# EAGLE design DCP23 (EAGLE 9.3.0)

## Sheet 1 of 2
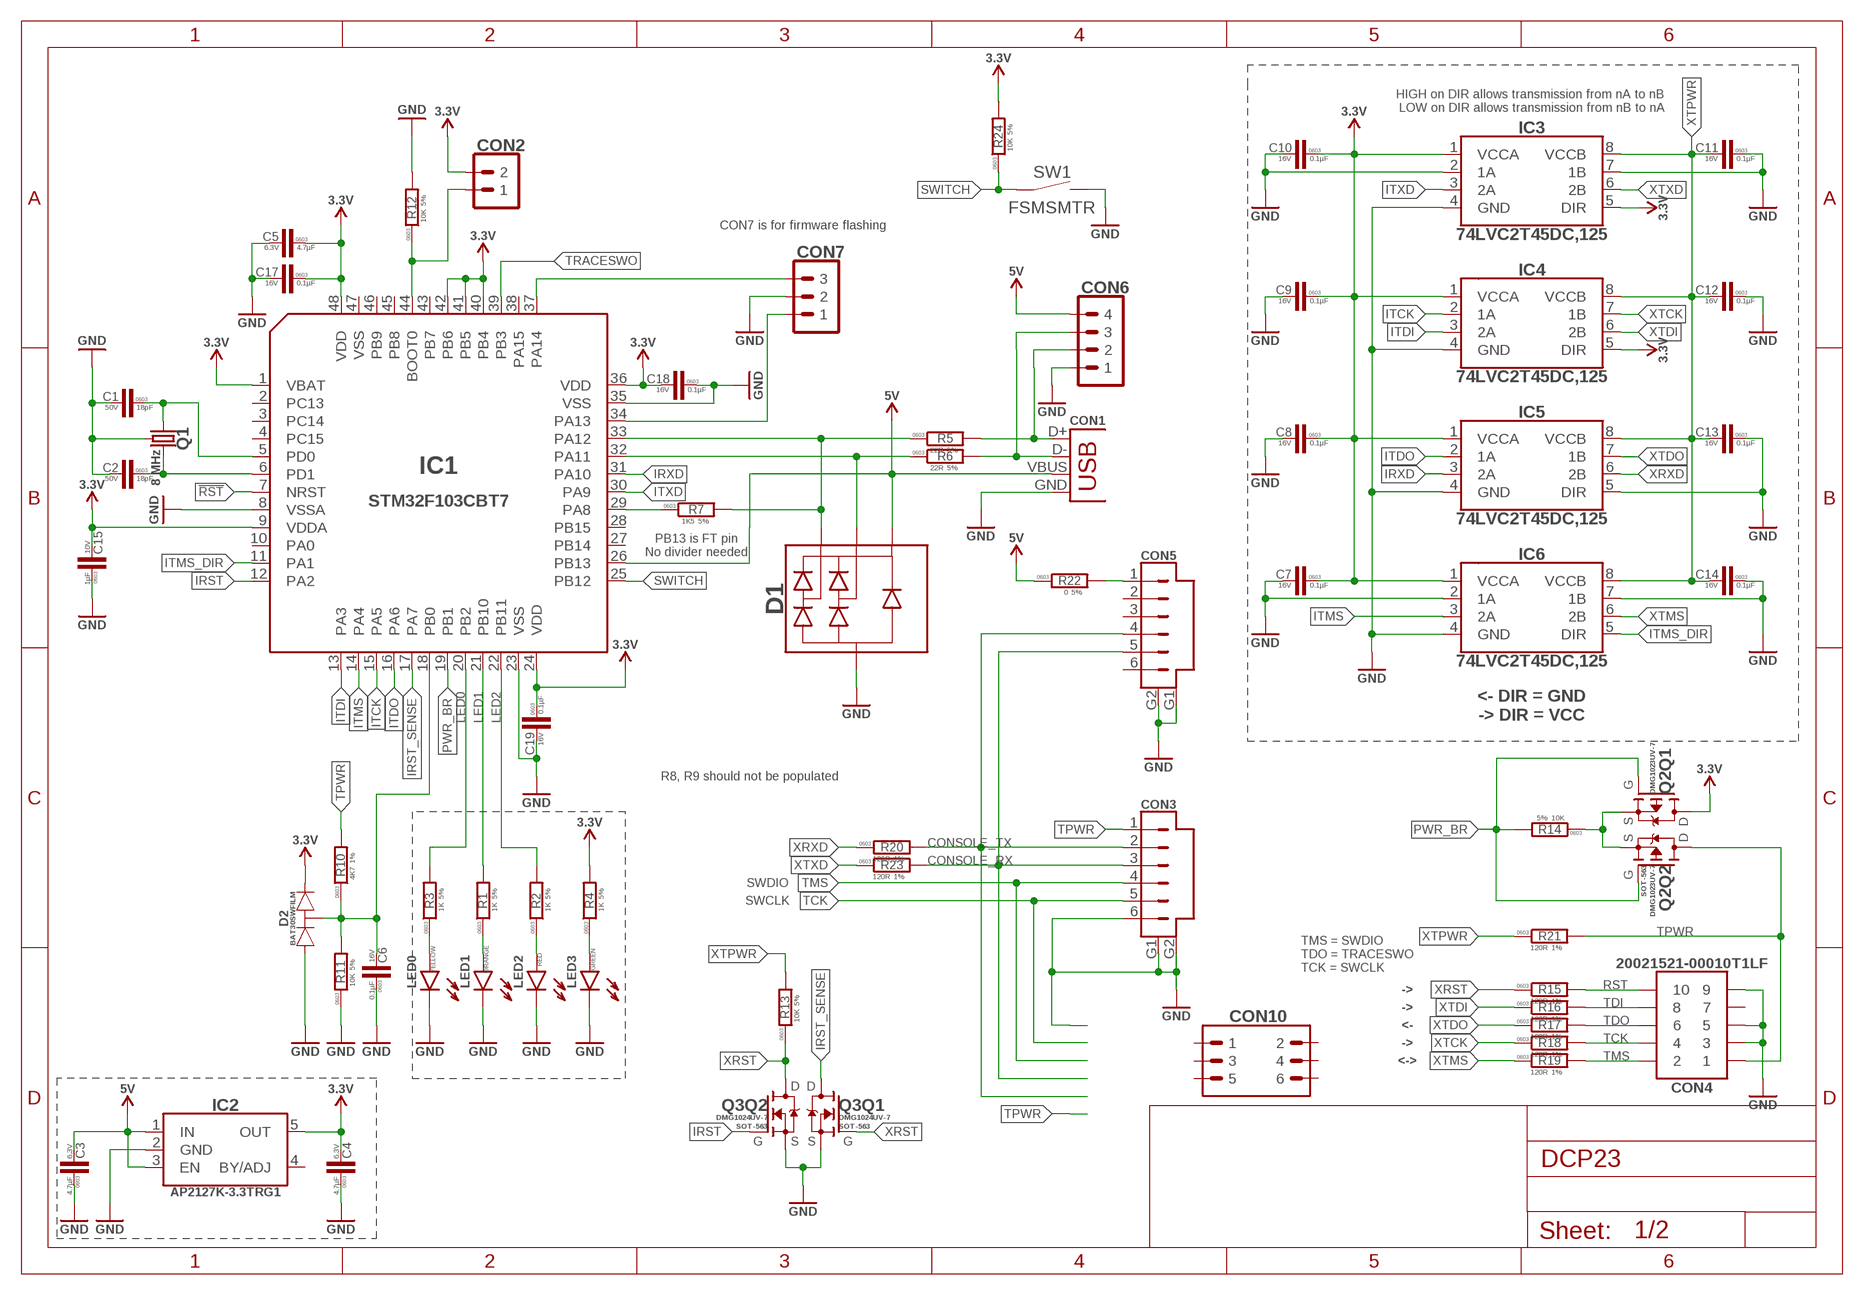
[diagram p0: schematic, sheet 1]

### Parts
C1  18pF  18PF-50V_5%_NP0-0603  [C0603]
C2  18pF  18PF-50V_5%_NP0-0603  [C0603]
C3  4.7µF  4.7µF-6.3V_10%_X5R-0603  [C0603]
C4  4.7µF  4.7µF-6.3V_10%_X5R-0603  [C0603]
C5  4.7µF  4.7µF-6.3V_10%_X5R-0603  [C0603]
C6  0.1µF  0.1µF-16V_10%_X7R-0603  [C0603]
C7  0.1µF  0.1µF-16V_10%_X7R-0603  [C0603]
C8  0.1µF  0.1µF-16V_10%_X7R-0603  [C0603]
C9  0.1µF  0.1µF-16V_10%_X7R-0603  [C0603]
C10  0.1µF  0.1µF-16V_10%_X7R-0603  [C0603]
C11  0.1µF  0.1µF-16V_10%_X7R-0603  [C0603]
C12  0.1µF  0.1µF-16V_10%_X7R-0603  [C0603]
C13  0.1µF  0.1µF-16V_10%_X7R-0603  [C0603]
C14  0.1µF  0.1µF-16V_10%_X7R-0603  [C0603]
C15  1µF  1µF-10V_10%_X5R-0603  [C0603]
C17  0.1µF  0.1µF-16V_10%_X7R-0603  [C0603]
C18  0.1µF  0.1µF-16V_10%_X7R-0603  [C0603]
C19  0.1µF  0.1µF-16V_10%_X7R-0603  [C0603]
CON1  USB-1  [MICRO_USB_WITH_PEGS]
CON2  PINHEAD_1X02-2  [1X02-PTH-2]
CON3  CON-6P-SM06B  [SM06B]
CON4  CON-2X5P  [200215-00010T1LF]
CON5  CON-6P-DF13  [DF13C-6P-1.25V]
CON6  PINHEAD_1X04-2.54  [1X04-PTH-2.54]
CON7  PINHEAD_1X03-2.54  [1X03-PTH-2.54]
CON10  PINHEAD_2X03-PTH-2.54  [2X03-PTH-2.54]
D1  PRTR5V0U2X  [SOT143B]
D2  BAT30SWFILM  [SC70]
IC1  STM32F103CBT7  [LQFP48]
IC2  AP2127-3.3  [SOT23-5]
IC3  74LVC2T45  [VSSOP8]
IC4  74LVC2T45  [VSSOP8]
IC5  74LVC2T45  [VSSOP8]
IC6  74LVC2T45  [VSSOP8]
LED0  LED-0603  [LED0603]
LED1  LED-0603  [LED0603]
LED2  LED-0603  [LED0603]
LED3  LED-0603  [LED0603]
Q1  8 MHz  CRYSTAL-4P-8MHZ-3.2X5-4P  [OSCILLATOR-5.0X3.2-4P]
Q2  DMG1023UV-7  [SOT-563]
Q3  DMG1024UV-7  [SOT-563]
R1  1K  1K-5%-0603  [R0603]
R2  1K  1K-5%-0603  [R0603]
R3  1K  1K-5%-0603  [R0603]
R4  1K  1K-5%-0603  [R0603]
R5  22R  R-5%-0603  [R0603]
R6  22R  R-5%-0603  [R0603]
R7  1K5  R-5%-0603  [R0603]
R10  4K7  4K7-1%-0603  [R0603]
R11  10K  10K-5%-0603  [R0603]
R12  10K  10K-5%-0603  [R0603]
R13  10K  10K-5%-0603  [R0603]
R14  10K  10K-5%-0603  [R0603]
R15  120R  120R-1%-0603  [R0603]
R16  120R  120R-1%-0603  [R0603]
R17  120R  120R-1%-0603  [R0603]
R18  120R  120R-1%-0603  [R0603]
R19  120R  120R-1%-0603  [R0603]
R20  120R  120R-1%-0603  [R0603]
R21  120R  120R-1%-0603  [R0603]
R22  0  0R-5%-0603  [R0603]
R23  120R  120R-1%-0603  [R0603]
R24  10K  10K-5%-0603  [R0603]
SW1  TACT_SWITCH-FSMSM  [FSMSM]

### Nets
!RST: IC1.7(NRST)
CONSOLE_RX: CON3.3 CON5.5 R23.P$2
CONSOLE_TX: CON3.2 CON5.4 R20.P$2
GND: C1.P$2 C2.P$2 C3.P$1 C4.P$1 C5.P$2 C6.P$1 C7.P$2 C8.P$2 C9.P$2 C10.P$2 C11.P$1 C12.P$1 C13.P$1 C14.P$1 C15.P$1 C17.P$2 C18.P$1 C19.P$2 CON1.GND CON3.6 CON3.G1 CON3.G2 CON4.3 CON4.5 CON4.9 CON5.G1(G2) CON5.G2(G1) CON6.1 CON7.2 D1.1(C) D2.1(A) IC1.8(VSSA) IC1.23(VSS) IC1.35(VSS) IC2.2(GND) IC3.2(1A) IC3.4(GND) IC3.7(1B) IC4.4(GND) IC5.4(GND) IC5.5(DIR) IC6.2(1A) IC6.4(GND) IC6.7(1B) LED0.C LED1.C LED2.C LED3.C Q1.2(GND) Q1.4(GND) Q3.1(Q1:S) Q3.4(Q2:S) R11.P$1 R12.P$2 SW1.P$2
IRST: IC1.12(PA2) Q3.5(Q2:G)
IRST_SENSE: IC1.17(PA7) Q3.6(Q1:D)
IRXD: IC1.31(PA10) IC5.3(2A)
ITCK: IC1.15(PA5) IC4.2(1A)
ITDI: IC1.13(PA3) IC4.3(2A)
ITDO: IC1.16(PA6) IC5.2(1A)
ITMS: IC1.14(PA4) IC6.3(2A)
ITMS_DIR: IC1.11(PA1) IC6.5(DIR)
ITXD: IC1.30(PA9) IC3.3(2A)
LED0: IC1.20(PB2) R3.P$2
LED1: IC1.21(PB10) R1.P$2
LED2: IC1.22(PB11) R2.P$2
N$1: C1.P$1 IC1.5(PD0) Q1.1
N$2: LED0.A R3.P$1
N$3: C2.P$1 IC1.6(PD1) Q1.3
N$4: LED2.A R2.P$1
N$5: LED1.A R1.P$1
N$6: LED3.A R4.P$1
N$7: IC1.29(PA8) R7.1
N$8: D1.3(D2) IC1.32(PA11) R6.1
N$9: D1.2(D1) IC1.33(PA12) R5.1 R7.2
N$10: CON1.D- CON6.3 R6.2
N$11: CON1.D+ CON6.2 R5.2
N$12: Q2.1(Q2:S) Q2.4(Q1:S) R14.P$1
N$13: CON5.1 R22.P$2
N$15: CON2.1 IC1.44(BOOT0) R12.P$1
PWR_BR: IC1.19(PB1) Q2.2(Q2:G) Q2.5(Q1:G) R14.P$2
RST: CON4.10 R15.P$2
SWCLK: CON7.3 IC1.37(PA14)
SWDIO: CON7.1 IC1.34(PA13)
SWITCH: IC1.25(PB12) R24.P$1 SW1.P$1
TCK: CON3.5 CON4.4 R18.P$2
TDI: CON4.8 R16.P$2
TDO: CON4.6 R17.P$2
TMS: CON3.4 CON4.2 R19.P$2
TPWR: CON3.1 CON4.1 Q2.6(Q2:D) R10.P$2 R21.P$2
TRACESWO: IC1.39(PB3)
VBUS1: C6.P$2 D2.3(COMMON) IC1.18(PB0) R10.P$1 R11.P$2
VDD_3V3: C4.P$2 C5.P$1 C7.P$1 C8.P$1 C9.P$1 C10.P$1 C15.P$2 C17.P$1 C18.P$2 C19.P$1 CON2.2 D2.2(C) IC1.1(VBAT) IC1.9(VDDA) IC1.24(VDD) IC1.36(VDD) IC1.40(PB4) IC1.41(PB5) IC1.42(PB6) IC1.48(VDD) IC2.5(OUT) IC3.1(VCCA) IC3.5(DIR) IC4.1(VCCA) IC4.5(DIR) IC5.1(VCCA) IC6.1(VCCA) Q2.3(Q1:D) R4.P$2 R24.P$2 ; supply symbol labelled 3.3V
VDD_5V: C3.P$2 CON1.VBUS CON6.4 D1.4(A) IC1.26(PB13) IC2.1(IN) IC2.3(EN) R22.P$1 ; supply symbol labelled 5V
XRST: Q3.2(Q1:G) Q3.3(Q2:D) R13.P$1 R15.P$1
XRXD: IC5.6(2B) R20.P$1
XTCK: IC4.7(1B) R18.P$1
XTDI: IC4.6(2B) R16.P$1
XTDO: IC5.7(1B) R17.P$1
XTMS: IC6.6(2B) R19.P$1
XTPWR: C11.P$2 C12.P$2 C13.P$2 C14.P$2 IC3.8(VCCB) IC4.8(VCCB) IC5.8(VCCB) IC6.8(VCCB) R13.P$2 R21.P$1
XTXD: IC3.6(2B) R23.P$1
Unconnected: CON4.7 CON5.2 CON5.3 CON5.6 CON10.1 CON10.2 CON10.3 CON10.4 CON10.5 CON10.6 IC1.2(PC13) IC1.3(PC14) IC1.4(PC15) IC1.10(PA0) IC1.27(PB14) IC1.28(PB15) IC1.38(PA15) IC1.43(PB7) IC1.45(PB8) IC1.46(PB9) IC1.47(VSS) IC2.4(BY/ADJ)

### Notes on the sheet
- HIGH on DIR allows transmission from nA to nB 
  LOW on DIR allows transmission from nB to nA
- CON7 is for firmware flashing
- PB13 is FT pin
  No divider needed
- <- DIR = GND
  -> DIR = VCC
- R8, R9 should not be populated
- SWDIO
- SWCLK
- TMS = SWDIO
  TDO = TRACESWO
  TCK = SWCLK
- ->
- ->
- <-
- ->
- <->

## Sheet 2 of 2

## Library data of the parts
C1 C2 = C_digikey:18PF; DIGIKEY#: 445-1272-2-ND; MANF: TDK Corporation; MANF#: C1608C0G1H180J080AA; OPERATING_TEMP: -55°C ~ 125°C; PACKAGE: 0603; TC: C0G, NP0; TOLERANCE: +-5%; VOLTAGE: 50V
C3-C5 = C_digikey:4.7µF; DIGIKEY#: 490-3297-1-ND; MANF: Murata Electronics North America; MANF#: GRM188R60J475KE19D; OPERATING_TEMP: -55°C ~ 85°C; PACKAGE: 0603; TC: X5R; TOLERANCE: +-10%; VOLTAGE: 6.3V
C6-C14 C17-C19 = C_digikey:0.1µF; DIGIKEY#: 490-1532-1-ND; MANF: Murata Electronics North America; MANF#: GRM188R71C104KA01D; OPERATING_TEMP: -55°C ~ 125°C; PACKAGE: 0603; TC: X7R; TOLERANCE: +-10%; VOLTAGE: 16V
C15 = C_digikey:1µF; DIGIKEY#: 490-1543-1-ND; MANF: Murata Electronics North America; MANF#: GRM188R61A105KA61D; OPERATING_TEMP: -55°C ~ 85°C; PACKAGE: 0603; TC: X5R; TOLERANCE: +-10%; VOLTAGE: 10V
CON1 = Connectors:USB: Connector Receptacle USB - micro B 2.0 5 Position; DIGIKEY#: 609-4616-1-ND; MANF: FCI; MANF#: 10118193-0001LF
CON2 = pinhead:PINHEAD_1X02: pinheader 2P
CON3 = Connectors:CON-6P: CONN HEADER 6 POS; DIGIKEY#: 455-1806-1-ND; MANF: JST Sales America Inc; MANF#: SM06B-SRSS-TB(LF)(SN)
CON4 = Connectors:CON-2X5P; DIGIKEY#: 609-4054-ND; MANF: Amphenol ICC (FCI); MANF#: 20021521-00010T1LF
CON5 = Connectors:CON-6P: CONN HEADER 6 POS; DIGIKEY#: H3423-ND; MANF: Hirose Electric Co Ltd; MANF#: DF13C-6P-1.25V(20)
CON6 = pinhead:PINHEAD_1X04
CON7 = pinhead:PINHEAD_1X03: pinheader 3P
CON10 = pinhead:PINHEAD_2X03
D1 = TVS_diodes:PRTR5V0U2X; DIGIKEY#: 568-4140-2-ND; MANF: NXP USA Inc; MANF#: PRTR5V0U2X,215
D2 = Diodes:BAT30SWFILM: Diode Array 1 Pair Series Connection Schottky 30V 300mA (DC) Surface Mount SC-70, SOT-323; DIGIKEY#: 497-5553-2-ND; MANF: STMicroelectronics; MANF#: BAT30SWFILM
IC1 = stm32:STM32F103CBT7: ARM® Cortex®-M3 STM32F1 Microcontroller IC 32-Bit 72MHz 128KB (128K x 8) FLASH 48-LQFP (7x7); DIGIKEY#: 497-11518-ND; MANF: STMicroelectronics; MANF#: STM32F103CBT7
IC2 = linear regulators:AP2127: IC REG LINEAR 3.3V 300MA SOT23-5; DIGIKEY#: AP2127K-3.3TRG1DITR-ND; I_MAX: 300mA; MANF: Diodes Incorporated; MANF#: AP2127K-3.3TRG1; V_MAX: 6V
IC3-IC6 = misc:74LVC2T45: Voltage Level Translator Bidirectional 1 Circuit 2 Channel 420Mbps; DIGIKEY#: 1727-4578-2-ND; MANF: Nexperia USA Inc; MANF#: 74LVC2T45DC,125
LED0 = rc:LED: SMD LED; COLOR: YELLOW
LED1 = rc:LED: SMD LED; COLOR: ORANGE
LED2 = rc:LED: SMD LED; COLOR: RED
LED3 = rc:LED: SMD LED; COLOR: GREEN
Q1 = crystal:CRYSTAL-4P: Smd Crystal 18pF; DIGIKEY#: 535-9720-2-ND; MANF: Abracon LLC; MANF#: ABM3B-8.000MHZ-B2-T
Q2 = mosfet:DMG1023UV-7: Mosfet Array 2 P-Channel (Dual) 20V 1.03A 530mW Surface Mount SOT-563; DIGIKEY#: DMG1023UV-7DICT-ND; MANF: Diodes Incorporated; MANF#: DMG1023UV-7; PACKAGE: SOT-563
Q3 = mosfet:DMG1024UV-7: Mosfet Array 2 N-Channel (Dual) 20V 1.38A 530mW Surface Mount SOT-563; DIGIKEY#: DMG1024UV-7DICT-ND; MANF: Diodes Incorporated; MANF#: DMG1024UV-7; PACKAGE: SOT-563
R1-R4 = R_digikey:1K; DIGIKEY#: 311-1.0KGRCT-ND; MANF: Yageo; MANF#: RC0603JR-071KL; PACKAGE: 0603; TOLERANCE: 5%
R5 R6 = rc:R; DIGIKEY#: 311-22NCT-ND; MANF: Yageo; MANF#: RC0201JR-0722RL; PACKAGE: 0603; TOLERANCE: 5%
R7 = rc:R; DIGIKEY#: 311-1.50KHRCT-ND; MANF: Yageo; MANF#: RC0603FR-071K5L; PACKAGE: 0603; TOLERANCE: 5%
R10 = R_digikey:4K7; DIGIKEY#: 311-4.70KHRCT-ND; MANF: Yageo; MANF#: RC0603FR-074K7L; PACKAGE: 0603; TOLERANCE: 1%
R11-R14 R24 = R_digikey:10K; DIGIKEY#: 311-10KGRCT-ND; MANF: Yageo; MANF#: RC0603JR-0710KL; PACKAGE: 0603; TOLERANCE: 5%
R15-R21 R23 = R_digikey:120R; DIGIKEY#: YAG3563CT-ND; MANF: Yageo; MANF#: AC0603FR-07120RL; PACKAGE: 0603; TOLERANCE: 1%
R22 = R_digikey:0R; DIGIKEY#: 311-0.0GRCT-ND; MANF: Yageo; MANF#: RC0603JR-070RL; PACKAGE: 0603; TOLERANCE: 5%
SW1 = misc:TACT_SWITCH: tact switch; DIGIKEY#: 450-1140-ND; I: 0.05A; MANF: TE Connectivity ALCOSWITCH Switches; MANF#: FSMSMTR; V: 24V

## Board
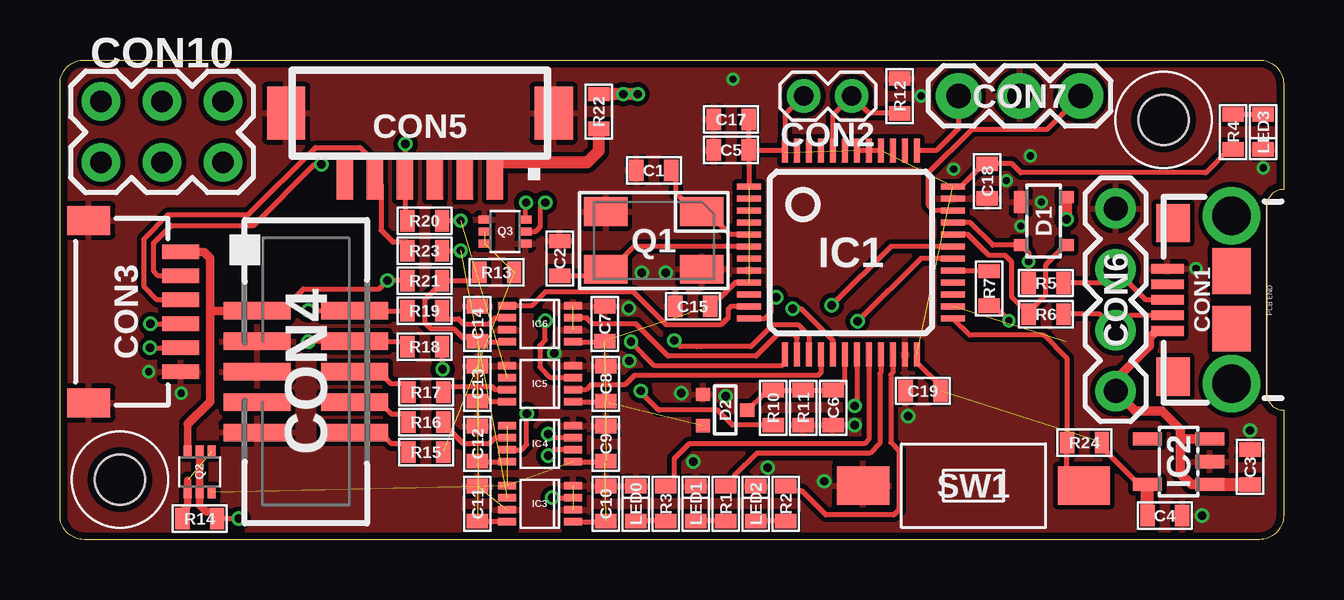
[diagram p1: board, top side]
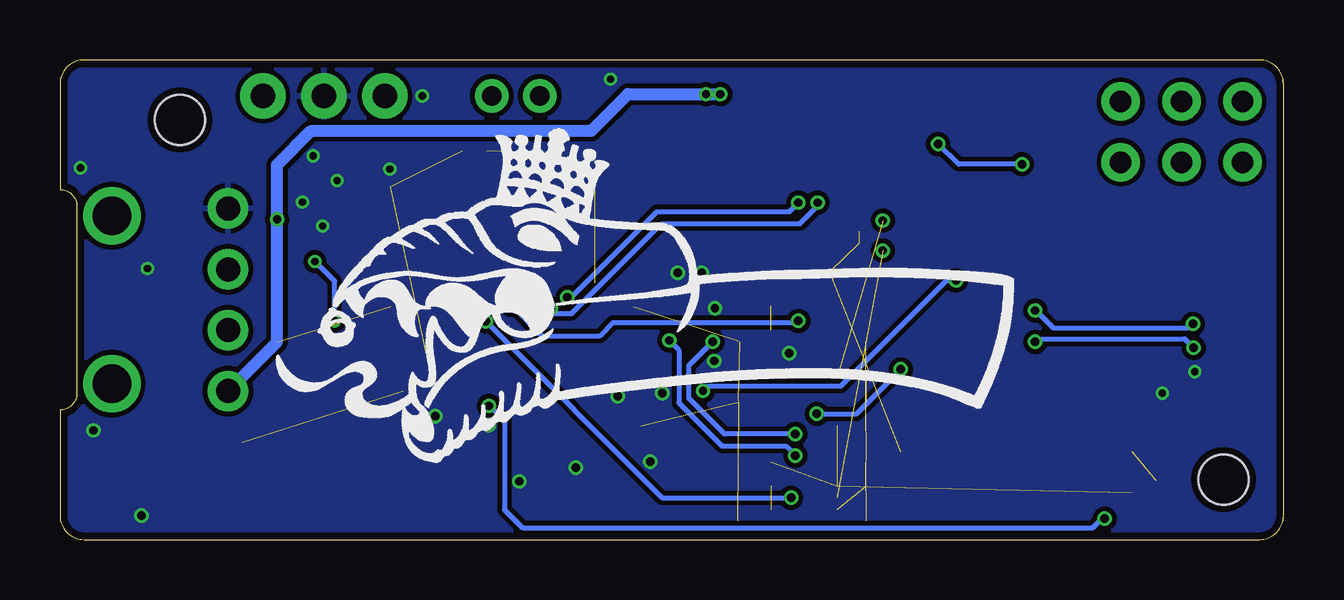
[diagram p2: board, bottom side, seen from below]

Size 51 x 20 mm. Coordinates in mm from the lower left corner, seen from the top.
Outline: 51,5.4 51,1 arc-90 50,0 1,0 arc-90 0,1 0,19 arc-90 1,20 50,20 arc-90 51,19 51,14.6 arc90 50.3,13.9 50.3,12.7 50.3,6.1 arc90 51,5.4
Copper layers (1*16): Top 0.035mm / dielectric 0.5mm / Bottom 0.035mm
Design rules "design_rules *": minimum track width 0.2mm, minimum drill 0.2mm, track to track 0.2mm, track to pad 0.2mm, pad to pad 0.2mm, via to via 0.2mm, smd to smd 0.15mm, copper to edge 0.3mm, drill to drill 0.2mm, minimum pad ring 0.125mm, minimum via ring 0.125mm, stop-mask expansion 1mil, vias tented up to drill 0.31mm, thermal gap 8mil
Holes 2.1 mm at 2.5,2.5 46,17.5

### Footprints (pad centres in the part's own frame; a part is rotated, then mirrored left to right if it is on the bottom)
C0603 = smd 0.6 x 0.9: P$1 -0.725,0; P$2 0.725,0
MICRO_USB_WITH_PEGS = smd 0.4 x 1.35: D+ 0,1.44; D- -0.65,1.44; GND 1.3,1.44; ID 0.65,1.44; VBUS -1.3,1.44 | smd 1.9 x 1.6: GND1 -1.2,-1.24; GND2 1.2,-1.24 | smd 1.6 x 1.4: GND3 -3.2,1.21; GND4 3.2,1.21 | drill 1.6 pad 2: P$1 -3.5,-1.24; P$2 3.5,-1.24
1X02-PTH-2 = drill 0.8 pad 1.4: 1 -1,0; 2 1,0
SM06B = smd 0.6 x 1.55: 1 -2.5,2.275; 2 -1.5,2.275; 3 -0.5,2.275; 4 0.5,2.275; 5 1.5,2.275; 6 2.5,2.275 | smd 1.2 x 1.8: G1 -3.8,-1.55; G2 3.8,-1.55
200215-00010T1LF = smd 0.737 x 2.794: 1 -2.54,-2.032; 2 -2.54,2.032; 3 -1.27,-2.032; 4 -1.27,2.032; 5 0,-2.032; 6 0,2.032; 7 1.27,-2.032; 8 1.27,2.032; 9 2.54,-2.032; 10 2.54,2.032
DF13C-6P-1.25V = smd 0.7 x 1.8: 1 -3.125,2.17; 2 -1.875,2.17; 3 -0.625,2.17; 4 0.625,2.17; 5 1.875,2.17; 6 3.125,2.17 | smd 1.6 x 2.2: G1 -5.575,-0.53; G2 5.575,-0.53
1X04-PTH-2.54 = drill 1 pad 1.7: 1 -3.81,0; 2 -1.27,0; 3 1.27,0; 4 3.81,0
1X03-PTH-2.54 = drill 1.016 pad 1.88: 1 -2.54,0; 2 0,0; 3 2.54,0
2X03-PTH-2.54 = drill 0.9 pad 1.6: 1 -1.27,2.54; 2 1.27,2.54; 3 -1.27,0; 4 1.27,0; 5 -1.27,-2.54; 6 1.27,-2.54
SOT143B = smd 0.9 x 0.6: 1 -0.8,-0.95 | smd 0.5 x 0.6: 2 1,-0.95; 3 1,0.95; 4 -1,0.95
SC70 = smd 0.55 x 0.6: 1 -0.65,-0.925; 2 0.65,-0.925; 3 0,0.925
LQFP48 = smd 1 x 0.25: 1 -4.25,2.75; 2 -4.25,2.25; 3 -4.25,1.75; 4 -4.25,1.25; 5 -4.25,0.75; 6 -4.25,0.25; 7 -4.25,-0.25; 8 -4.25,-0.75; 9 -4.25,-1.25; 10 -4.25,-1.75; 11 -4.25,-2.25; 12 -4.25,-2.75; 25 4.25,-2.75; 26 4.25,-2.25; 27 4.25,-1.75; 28 4.25,-1.25; 29 4.25,-0.75; 30 4.25,-0.25; 31 4.25,0.25; 32 4.25,0.75; 33 4.25,1.25; 34 4.25,1.75; 35 4.25,2.25; 36 4.25,2.75 | smd 0.25 x 1: 13 -2.75,-4.25; 14 -2.25,-4.25; 15 -1.75,-4.25; 16 -1.25,-4.25; 17 -0.75,-4.25; 18 -0.25,-4.25; 19 0.25,-4.25; 20 0.75,-4.25; 21 1.25,-4.25; 22 1.75,-4.25; 23 2.25,-4.25; 24 2.75,-4.25; 37 2.75,4.25; 38 2.25,4.25; 39 1.75,4.25; 40 1.25,4.25; 41 0.75,4.25; 42 0.25,4.25; 43 -0.25,4.25; 44 -0.75,4.25; 45 -1.25,4.25; 46 -1.75,4.25; 47 -2.25,4.25; 48 -2.75,4.25
SOT23-5 = smd 0.55 x 1.2: 1 -0.95,-1.3; 2 0,-1.3; 3 0.95,-1.3; 4 0.95,1.3; 5 -0.95,1.3
VSSOP8 = smd 0.75 x 0.3: 1 -1.375,0.75; 2 -1.375,0.25; 3 -1.375,-0.25; 4 -1.375,-0.75; 5 1.375,-0.75; 6 1.375,-0.25; 7 1.375,0.25; 8 1.375,0.75
LED0603 = smd 0.6 x 0.9: A -0.725,0; C 0.725,0
OSCILLATOR-5.0X3.2-4P = smd 1.8 x 1.2: 1 -2,-1.2; 2 2,-1.2; 3 2,1.2; 4 -2,1.2
SOT-563 = smd 0.5 x 0.325: 1 -0.85,0.5; 2 -0.85,0; 3 -0.85,-0.5; 4 0.85,-0.5; 5 0.85,0; 6 0.85,0.5
R0603 = smd 0.6 x 0.9: P$1 -0.725,0; P$2 0.725,0
R0603' = smd 0.6 x 0.9: 1 -0.725,0; 2 0.725,0
FSMSM = smd 2.18 x 1.6: P$1 -4.6,0; P$2 4.6,0

### Placement (x,y rotation side)
C1  24.75,15.4 180 top
C2  20.82,11.72 90 top
C3  49.6,3.03 270 top
C4  46.05,1 180 top
C5  27.98,16.25 180 top
C6  32.23,5.5 90 top
C7  22.7,9 90 top
C8  22.75,6.5 90 top
C9  22.75,4 90 top
C10  22.75,1.5 90 top
C11  17.4,1.5 270 top
C12  17.4,4 270 top
C13  17.4,6.5 270 top
C14  17.4,9 270 top
C15  26.38,9.72 0 top
C17  27.98,17.52 180 top
C18  38.65,14.95 90 top
C19  35.98,6.2 180 top
CON1  47.6,10 90 top
CON2  32,18.5 180 top
CON3  2.75,9.5 270 top
CON4  10.25,7 270 top
CON5  15,17.25 180 top
CON6  44,10 270 top
CON7  40,18.5 180 top
CON10  4.25,17 90 top
D1  41,13.28 270 top
D2  27.73,5.4 270 top
IC1  32.98,11.97 0 top
IC2  46.62,3.25 90 top
IC3  20,1.5 180 top
IC4  20,4 180 top
IC5  20,6.5 180 top
IC6  20,9 180 top
LED0  24,1.5 90 top
LED1  26.5,1.5 90 top
LED2  29,1.5 90 top
LED3  50.15,17 270 top
Q1  24.75,12.47 180 top
Q2  5.82,2.83 90 top
Q3  18.55,12.85 0 top
R1  27.75,1.5 90 top
R2  30.25,1.5 90 top
R3  25.25,1.5 90 top
R4  48.9,17 270 top
R5  22R  [R0603']  41.1,10.7 0 top
R6  22R  [R0603']  41.1,9.4 0 top
R7  1K5  [R0603']  38.73,10.47 270 top
R10  29.73,5.5 270 top
R11  30.98,5.5 90 top
R12  35,18.5 90 top
R13  18.2,11.15 180 top
R14  5.82,0.88 0 top
R15  15.25,3.65 180 top
R16  15.25,4.9 180 top
R17  15.25,6.15 180 top
R18  15.2,8.05 180 top
R19  15.2,9.55 180 top
R20  15.2,13.3 180 top
R21  15.2,10.8 180 top
R22  22.45,17.85 270 top
R23  15.2,12.05 180 top
R24  42.7,4.05 0 top
SW1  38.08,2.25 180 top
U$1  [DRAGON-30X13]  42,3.15 0 bottom

### Tracks (layer width: path | path; a pad name or v marks a point on that pad's centre or on a via)
CONSOLE_RX
  Top 0.2: CON3.3 4.05,10 3.5,10.55 3.5,12.54 4.51,13.55 7.85,13.55 10.65,16.35 12.5,16.35 13.1,15.75 13.1,15.05 | 13.1,15.05 CON5.5 13.38,14.83 13.38,12.9 13.88,12.4 14.47,12.4 R23.P$2 | 13.1,14.45 13.1,15.05
CONSOLE_TX  (via drill 0.35)
  Top 0.2: CON3.2 4.1,11 3.9,11.2 3.9,12.37 4.63,13.1 8.07,13.1 10.62,15.65 v10.9,15.65 | v14.4,16.5 14.38,16.48 CON5.4 14.38,13.4 R20.P$2
  Bottom 0.2: v10.9,15.65 13.55,15.65 v14.4,16.5
GND  (via drill 0.3 pad 0.55, 0.35)  (4 unrouted)
  Top 0.2: 35.12,6.33 C19.P$2 | D1.1 40.15,14.07 | 38.5,14.38 C18.P$1
  other vias: 47.35,11.3 50.15,15.5 40.9,14.07 31.85,2.42 29.5,3 26.4,3.25 49.6,4.55 47.6,1 33.12,4.78 27.75,5.97 39.45,14.97 35.35,5.15 40.45,16 37.25,15.45 35.9,18.5 28.05,19.2 40.05,13.07 5.05,6.1 3.7,7 25.9,6.1 23.7,9.65 24.25,11.12 25.25,11.12 23.73,7.45 20.6,7.78
  pour Bottom: 0,20 51,20 51,0 0,0
  pour Top: 0,20 51,20 51,0 0,0
IRST  (via drill 0.35)
  Top 0.2: IC1.12 29.38,9.22 29.65,9.5 29.65,9.9 v29.85,10.1 | Q3.5 19.82,12.85 20.02,13.05 20.02,13.85 v20.23,14.05
  Bottom 0.2: v29.85,10.1 29.7,10.1 26.12,13.68 20.6,13.68 v20.23,14.05
IRST_SENSE  (via drill 0.35)
  Top 0.2: IC1.17 32.23,8.3 30.9,9.62 v30.55,9.62 | Q3.6 19.4,14.03 v19.43,14.05
  Bottom 0.2: v30.55,9.62 30.35,9.43 29.68,9.43 25.93,13.18 20.15,13.18 19.43,13.9 v19.43,14.05
IRXD  (via drill 0.35)
  Top 0.2: IC1.31 34.62,12.22 v32.17,9.77 | IC5.3 20.45,6.75 20,7.2 20,8.1 20.23,8.32 v20.23,9.12
  Bottom 0.2: v32.17,9.77 30.9,8.5 28.5,8.5 27.95,9.05 20.3,9.05 v20.23,9.12
ITCK  (via drill 0.35)
  Top 0.2: IC1.15 31.23,8.5 30.77,8.95 29.7,8.95 28.8,8.05 26.7,8.05 | 26.7,8.05 26.55,8.05 | 26.7,8.05 25.85,8.05 v25.6,8.3 | IC4.2 20.6,3.75 v20.35,3.5
  Bottom 0.2: v25.6,8.3 25.2,7.9 25.2,5.7 23.4,3.9 20.75,3.9 v20.35,3.5
ITDI  (via drill 0.35)
  Top 0.2: IC1.13 30.23,7.4 30.07,7.25 24.78,7.25 23.8,8.23 v23.8,8.25 | IC4.3 20.5,4.25 v20.35,4.4
  Bottom 0.2: v23.8,8.25 24.8,7.25 24.8,5.9 23.3,4.4 v20.35,4.4
ITDO
  Top 0.2: IC1.16 31.73,6.97 31.6,6.85 23.95,6.85 23.55,6.45 22.12,6.45 21.92,6.25 IC5.2
ITMS
  Top 0.2: IC1.14 30.73,8.43 30.6,8.55 29.92,8.55 29.02,7.65 25.35,7.65 24,9 22.2,9 21.95,9.25 IC6.3
ITMS_DIR
  Top 0.2: IC1.11 27.98,9.72 27.85,9.6 27.85,9.25 27.55,8.95 25.27,8.95 23.9,10.32 20.23,10.32 19.65,9.75 IC6.5
ITXD  (via drill 0.35)
  Top 0.2: IC1.30 35.88,11.72 v33.25,9.1 | v20.52,1.75 IC3.3
  Bottom 0.2: v33.25,9.1 25.9,1.75 v20.52,1.75
LED0
  Top 0.2: IC1.20 33.73,4.2 33.52,4 26.23,4 25.6,3.38 25.6,2.25 25.57,2.22 R3.P$2
LED1
  Top 0.2: IC1.21 34.23,6.97 34.17,6.92 34.17,4.03 33.75,3.6 29.05,3.6 28.1,2.65 28.1,2.33 28,2.22 R1.P$2
LED2
  Top 0.2: IC1.22 34.73,6.97 34.62,6.88 34.62,4.05 34.98,3.7 34.98,1.25 34.75,1.03 31.93,1.03 30.93,2.03 30.45,2.03 R2.P$2
N$1
  Top 0.2: IC1.5 27.93,12.72 26.98,13.68 Q1.1 | Q1.1 26.55,13.68 | Q1.1 26.45,13.68 25.68,14.45 25.68,15.2 C1.P$1
N$2
  Top 0.2: 24.9,0.78 R3.P$1 LED0.A
N$3
  Top 0.2: IC1.6 23.93,12.22 22.98,11.28 Q1.3 arc-90 22.48,11 C2.P$1
N$4
  Top 0.2: R2.P$1 LED2.A
N$5
  Top 0.2: 27.4,0.78 R1.P$1 LED1.A
N$6
  Top 0.2: LED3.A R4.P$1
N$7
  Top 0.2: IC1.29 38.73,11.22 R7.1
N$8
  Top 0.2: D1.3 41.9,12.28 41.1,11.47 41.1,10.2 40.38,9.47 R6.1 39.67,10.1 39.67,11.57 39.4,11.85 38.73,11.85 37.85,12.72 IC1.32
N$9  (via drill 0.3 pad 0.55)
  Top 0.2: 40.25,10.82 R5.1 | R5.1 40.17,10.9 | R5.1 v40.38,11.6 40.38,11.95 D1.2 38.88,12.28 37.92,13.22 IC1.33 | R7.2 38.95,9.75 39.55,9.15 v39.55,9.12
  Bottom 0.2: v39.55,9.12 39.55,10.78 v40.38,11.6
N$10
  Top 0.2: CON1.D- 44.62,9.35 CON6.3 43.33,9.4 R6.2
N$11
  Top 0.2: CON1.D+ 45.27,10 CON6.2 43.43,10.7 R5.2
N$12  (1 unrouted)
  Top 0.32: 5.32,2.47 Q2.1 5.32,1.4 5.1,1.18 R14.P$1
N$13
  Top 0.5: R22.P$2 22.45,16.2 21.98,15.72 18.18,15.72 18.12,15.68 CON5.1
N$15
  Top 0.2: IC1.44 32.23,17.73 CON2.1 33.73,17.77 R12.P$1
PWR_BR  (via drill 0.35)
  Top 0.2: IC1.19 33.23,5.67 v33.12,5.58 | v7.45,0.88 6.68,0.88 6.55,1
  Top 0.32: R14.P$2 6.55,1 6.4,1.15 6.1,1.15 5.82,1.43 Q2.2 Q2.5
  Bottom 0.2: v33.12,5.58 33.08,5.58 32.48,4.97 32.48,1.25 31.73,0.5 7.95,0.5 7.57,0.88 v7.45,0.88
RST
  Top 0.2: CON4.10 12.53,4.21 13.62,4.21 13.82,4 14.47,4 14.53,3.95 R15.P$2
SWCLK
  Top 0.2: CON7.3 37.46,17.16 36.52,16.23 IC1.37
SWDIO
  Top 0.2: IC1.34 36.42,13.72 36.2,13.95 36.2,15.3 38.02,17.12 41.16,17.12 CON7.1
SWITCH
  Top 0.2: 41.98,2.95 SW1.P$1 41.98,2.95 | 37.62,9.22 IC1.25 37.92,8.53 41,8.53 41.98,7.55 R24.P$1 41.98,2.95
TCK  (via drill 0.35)
  Top 0.2: R18.P$2 14.26,8.27 CON4.4 10.37,8.27 v10.35,8.25 | v3.75,8 CON3.5
  Bottom 0.2: v10.35,8.25 10.23,8.38 4.12,8.38 v3.75,8
TDI
  Top 0.2: 12.35,5.8 CON4.8 13.32,5.73 13.8,5.25 14.4,5.25 14.53,5.12 R16.P$2
TDO
  Top 0.2: CON4.6 12.53,6.75 13.55,6.75 13.8,6.5 14.53,6.5 R17.P$2
TMS  (via drill 0.35)
  Top 0.2: v10.35,9.55 v10.36,9.54 CON4.2 R19.P$2 | v3.77,9 CON3.4
  Bottom 0.2: v10.35,9.55 10.32,9.55 9.6,8.82 3.95,8.82 v3.77,9
TPWR  (via drill 0.35)
  Top 0.2: CON4.1 9.24,9.54 10.15,10.45 13.3,10.45 v13.65,10.8 R21.P$2 14.47,10.45 | R10.P$2 28.02,4.78 27.4,5.4 24.95,5.4 24.2,6.15 v24.2,6.2
  Top 0.32: Q2.6 5.32,4.83
  Top 0.35: 5.32,4.83 6.25,5.75 6.25,9.5 | CON3.1 6,12 6.25,11.75 6.25,9.5 | CON4.1 6.29,9.54 6.25,9.5
  Top 0.4: 7.16,9.54 CON4.1
  Bottom 0.2: v24.2,6.2 24,6.4 18.45,6.4 14.05,10.8 v13.65,10.8
VBUS1
  Top 0.2: IC1.18 32.73,6.62 32.33,6.22 C6.P$2 R11.P$2 R10.P$1 29.62,6.12 29.38,6.12 D2.3
VDD_3V3  (13 unrouted)
  Top 0.2: 35.73,7.35 IC1.24 35.73,7.38 36.7,6.4 C19.P$1 | IC1.9 28.5,10.72 28.15,10.72 27.5,10.07 27.2,10.07 27.1,9.97 C15.P$2 | C5.P$1 28.73,16.23 | 28.73,16.23 IC1.1 | C5.P$1 30.2,16.25 IC1.48 30.23,16.12 30.23,17.73 CON2.2 | C17.P$1 C5.P$1 | C5.P$1 28.73,16.23 | IC1.36 37.55,14.72 38.5,15.68 C18.P$2 39.67,15.68 40.05,15.3 47.75,15.3 48.73,16.27 R4.P$2 | IC1.40 IC1.41 IC1.42 | IC6.1 22.68,8.25 C7.P$1 | IC4.1 22.73,3.25 C9.P$1 | IC5.1 22.73,5.75 C8.P$1 | IC3.1 22.73,0.75 C10.P$1 | IC2.5 44.98,2.3 43.42,3.85 R24.P$2
  Top 0.55: C4.P$2 IC2.5
VDD_5V  (via drill 0.35)  (1 unrouted)
  Top 0.4: CON1.VBUS 45.7,8.7 45.4,8.4 45.4,8.07 44,6.67 CON6.4 44.81,5.38 45.92,5.38 46.7,4.6 46.7,4.17 | 47.45,4.2 IC2.3 46.73,4.2 46.7,4.17 | IC2.1 47.15,2.3 46.7,2.75 46.7,4.17
  Top 0.5: v41.95,13.35 D1.4 | v24.07,18.57 v23.48,18.57 R22.P$1
  Top 0.55: IC2.1 C3.P$2
  Bottom 0.5: CON6.4 41.95,8.24 v41.95,13.35 41.95,15.62 40.52,17.05 28.85,17.05 27.32,18.57 v23.48,18.57
XRST  (3 unrouted)
XRXD  (via drill 0.35)  (1 unrouted)
  Top 0.2: R20.P$1 v16.7,13.3
XTCK  (via drill 0.35)
  Top 0.2: R18.P$1 15.93,7.12 v15.95,7.1 | IC4.7 19.25,3.75 19.45,3.95 v19.45,5.25
  Bottom 0.2: v19.45,5.25 17.8,5.25 v15.95,7.1
XTDI
  Top 0.2: IC4.6 18.13,4.25 17.88,4 16.82,4 15.97,4.85 R16.P$1
XTDO
  Top 0.2: IC5.7 18.15,6.25 18.02,6.38 16.2,6.38 R17.P$1
XTMS
  Top 0.2: R19.P$1 15.93,9.2 16.62,9.2 16.82,9 17.88,9 18.13,9.25 IC6.6
XTPWR  (3 unrouted)
  Top 0.2: IC5.8 17.43,5.75 C13.P$2 | IC3.8 17.43,0.75 C11.P$2 | IC6.8 17.43,8.25 C14.P$2 17.25,8.43 16.77,8.43 16.4,8.8 15.45,8.8 15.2,9.05 15.2,10 15.93,10.72 R21.P$1 17.48,10.8 R13.P$2 | C12.P$2 17.43,3.25 IC4.8
XTXD  (via drill 0.35)  (1 unrouted)
  Top 0.2: R23.P$1 v16.7,12.05

### Text on the board
Reference: DCP2.2 dimensions 44x22